# EAGLE schematic display (EAGLE 7.5.0)
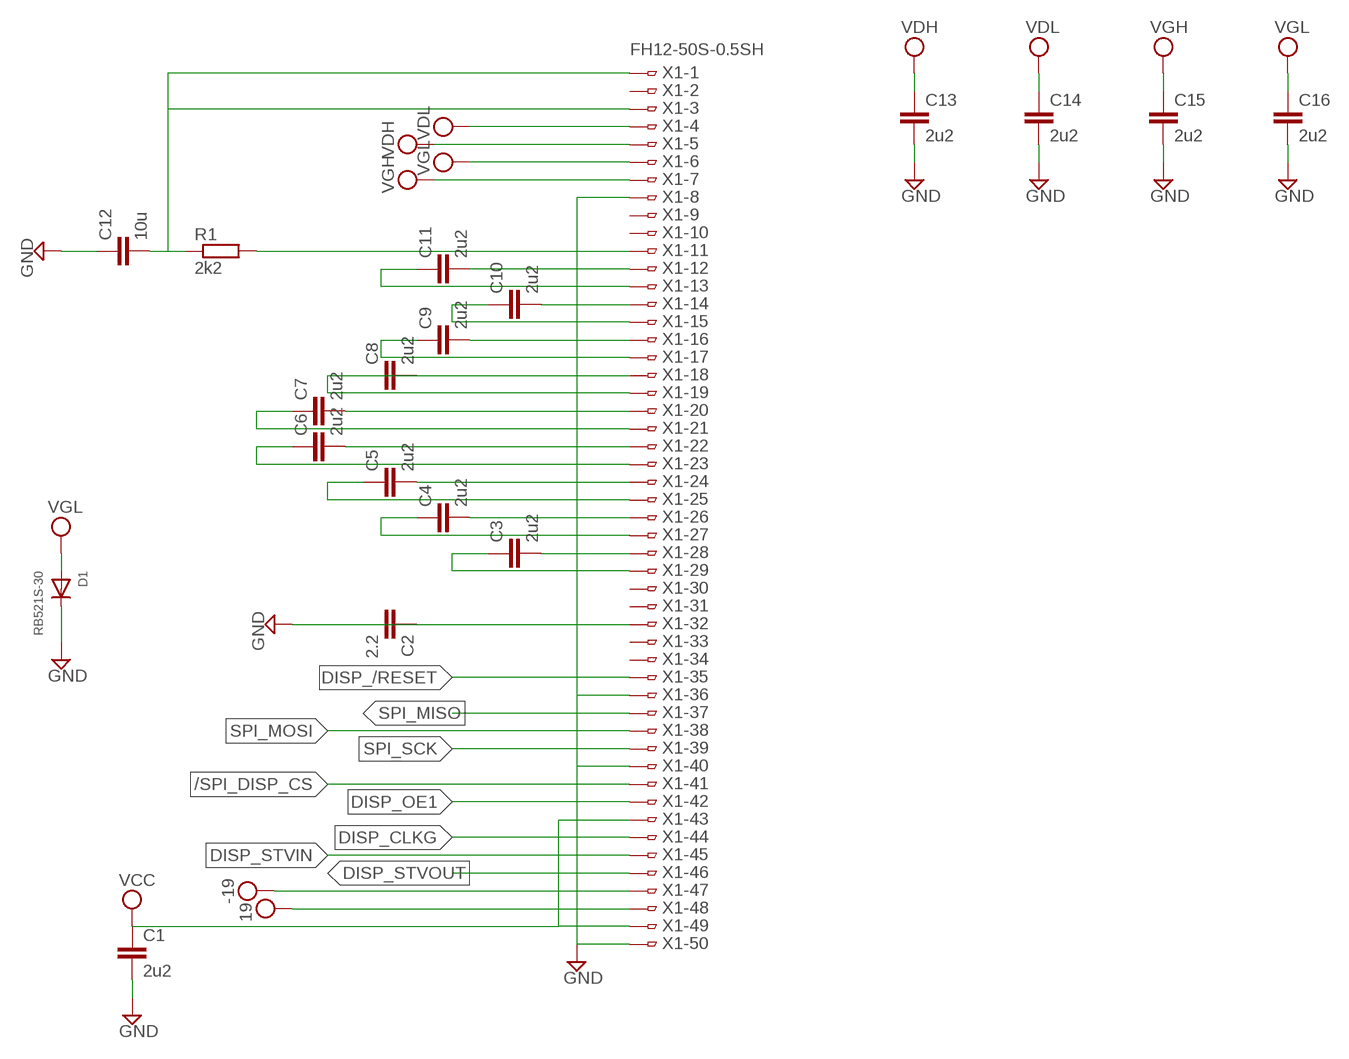
[diagram p0: schematic, sheet 1]

## Parts
C1  2u2  C-EUC0603  [C0603]
C2  2.2  C-EUC0603  [C0603]
C3  2u2  C-EUC1608  [C1608]
C4  2u2  C-EUC1608  [C1608]
C5  2u2  C-EUC1608  [C1608]
C6  2u2  C-EUC1608  [C1608]
C7  2u2  C-EUC1608  [C1608]
C8  2u2  C-EUC1608  [C1608]
C9  2u2  C-EUC1608  [C1608]
C10  2u2  C-EUC1608  [C1608]
C11  2u2  C-EUC1608  [C1608]
C12  10u  C-EUC1608  [C1608]
C13  2u2  C-EUC1608  [C1608]
C14  2u2  C-EUC1608  [C1608]
C15  2u2  C-EUC1608  [C1608]
C16  2u2  C-EUC1608  [C1608]
D1  RB521S-30  DIODESOD-523  [SOD-523]
R1  2k2  R-EU_R0603  [R0603]
X1  FH12-50S-0.5SH  [FH12-50S-0.5SH]

## Nets
/SPI_DISP_CS: X1.41
DISP_/RESET: X1.35
DISP_CLKG: X1.44
DISP_OE1: X1.42
DISP_STVIN: X1.45
DISP_STVOUT: X1.46
GND: C1.2 C2.1 C2.2 C12.1 C13.2 C14.2 C15.2 C16.2 D1.K(C) X1.8 X1.32 X1.36 X1.40 X1.50
N$1: C3.1 X1.29
N$2: C3.2 X1.28
N$3: C4.1 X1.27
N$4: C4.2 X1.26
N$5: C5.1 X1.25
N$6: C5.2 X1.24
N$7: C6.1 X1.23
N$8: C6.2 X1.22
N$9: C7.1 X1.21
N$10: C7.2 X1.20
N$11: C8.1 C8.2 X1.18 X1.19
N$12: C9.1 X1.17
N$13: C9.2 X1.16
N$14: C10.1 X1.15
N$15: C10.2 X1.14
N$16: C11.1 X1.13
N$17: C11.2 X1.12
N$18: C12.2 R1.1 X1.1 X1.3
N$19: R1.2 X1.11
SPI_MISO: X1.37
SPI_MOSI: X1.38
SPI_SCK: X1.39
VCD: C1.1 X1.43 X1.49 ; supply symbol labelled VCC
VDH: C13.1 X1.5
VDL: C14.1 X1.4
VGH: C15.1 X1.7 X1.48 ; supply symbol labelled 19
VGL: C16.1 D1.A X1.6 X1.47 ; supply symbol labelled -19
Unconnected: X1.2 X1.9 X1.10 X1.30 X1.31 X1.33 X1.34

## Library data of the parts
C1-C16 = rcl:C-EU: CAPACITOR, European symbol
D1 = adafruit:DIODE: Diode SMADIODE - SMA Surface Mount Package 20V 1A Schottky Diode Digikey: 641-1014-6-ND DO-1N4148 - Through Hole Small Current Diode SOD-123 20V 1 A (.5mV Vf) Schottky Diode - Digikey: MBRX120TPMSCT-ND SOD-323 10V 570mA (.38mV Vf, 3ns) Schottky Diode - Digikey: ZLLS410CT-ND SOD-523 30V 30mA Schottky Diode (RB751S-40TE61) - Digikey: RB751S-40TE61CT-ND SOT23-R/W - SOT23 Package (R = Solder Paste/Reflow Ovens, W = Hand-Soldering) BAT54Film 40V 300mA - Digikey: 497-7162-1-ND
R1 = rcl:R-EU_: RESISTOR, European symbol
X1 = con-hirose:FH12-50S-0.5S: 0.5mm Pitch Connectors For FPC/FFC Source: Data sheet <http://www.hirose.co.jp/cataloge_hp/e58605370.pdf>; MPN: FH12-50S-0.5SH(55); OC_FARNELL: 1324557; OC_NEWARK: 34M6181